# Altium schematic sheet ZeroDetect.SchDoc
size B; Author: E. Sims; Organization: Let's Build Rockets Inc.; SheetNumber: 3; SheetTotal: 3
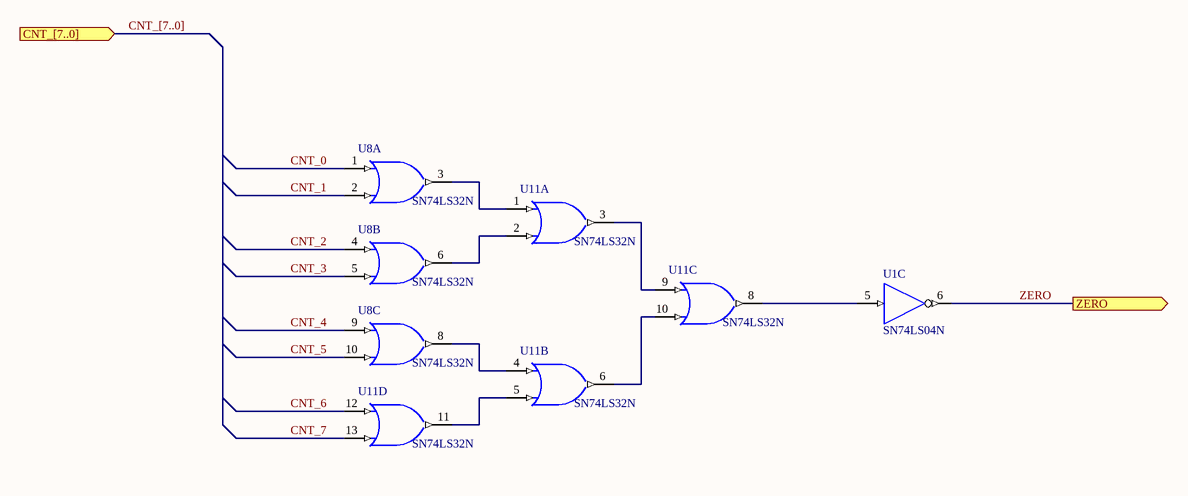
[diagram p0: ZeroDetect.SchDoc]

## Parts
U1  SN74LS04N  [N014]  (part C of 6)
U8  SN74LS32N  [N014]  (parts A,B,C of 4)
U11  SN74LS32N  [N014]  (parts A,B,C,D of 4)

## Ports
CNT_[7..0] (in), ZERO (out)

## Nets
GND: U1.7(GND) U8.7(GND) U11.7(GND)
VCC: U1.14(VCC) U8.14(VCC) U11.14(VCC)
CNT_0: U8.1(A)
CNT_1: U8.2(B)
CNT_2: U8.4(A)
CNT_3: U8.5(B)
CNT_4: U8.9(A)
CNT_5: U8.10(B)
CNT_6: U11.12(A)
CNT_7: U11.13(B)
ZERO: U1.6(Y) ; port ZERO
NetU1_5: U1.5(A) U11.8(Y)
NetU8_3: U8.3(Y) U11.1(A)
NetU8_6: U8.6(Y) U11.2(B)
NetU8_8: U8.8(Y) U11.4(A)
NetU11_3: U11.3(Y) U11.9(A)
NetU11_5: U11.5(B) U11.11(Y)
NetU11_6: U11.6(Y) U11.10(B)

## Buses and harness runs
bus CNT_[7..0] = port CNT_[7..0]

## Notes on the sheet
- Let's Build Rocket's Inc. Modular Paylaod System Based on TMP-010 Rev
  For more information visit https://github.com/LetsBuildRockets/Modular-Payload-System
  This work is licensed under CC BY-NC 4.0. To view a copy of this license, visit https://creativecommons.org/licenses/by-nc/4.0
- Title
- Size:
- Date:
- Assembly Variant:
- B
- Number:
- Time:
- Revision:
- Sheet
- of
- Author:
- File:

## Library data of the parts
U1 = SN74LS04N: Hex Inverter; Published: 8-Jun-2000; LatestRevisionDate: 04-Mar-2005; LatestRevisionNote: Stylized 3D Model Added.; DatasheetVersion: Mar-1988; PackageVersion: Oct-1995; PackageReference: N014; Publisher: Altium Limited; PackageDescription: DIP; 14 Leads; Row Spacing 7.62 mm; Pitch 2.54 mm; ComponentLink1Description: Manufacturer Link; ComponentLink1URL: http://www.ti.com/; ComponentLink2Description: Datasheet; ComponentLink2URL: http://www-s.ti.com/sc/ds/sn74ls04.pdf
U8 U11 = SN74LS32N: Quadruple 2-Input Positive-OR Gate; Published: 8-Jun-2000; LatestRevisionDate: 04-Mar-2005; LatestRevisionNote: Stylized 3D Model Added.; DatasheetVersion: Mar-1988; PackageVersion: Oct-1995; PackageReference: N014; Publisher: Altium Limited; PackageDescription: DIP; 14 Leads; Row Spacing 7.62 mm; Pitch 2.54 mm; ComponentLink1Description: Manufacturer Link; ComponentLink1URL: http://www.ti.com/; ComponentLink2Description: Datasheet; ComponentLink2URL: http://www-s.ti.com/sc/ds/sn74ls32.pdf